# Altium schematic sheet Sheet3.SchDoc
size A; SheetNumber: 1; SheetTotal: 1
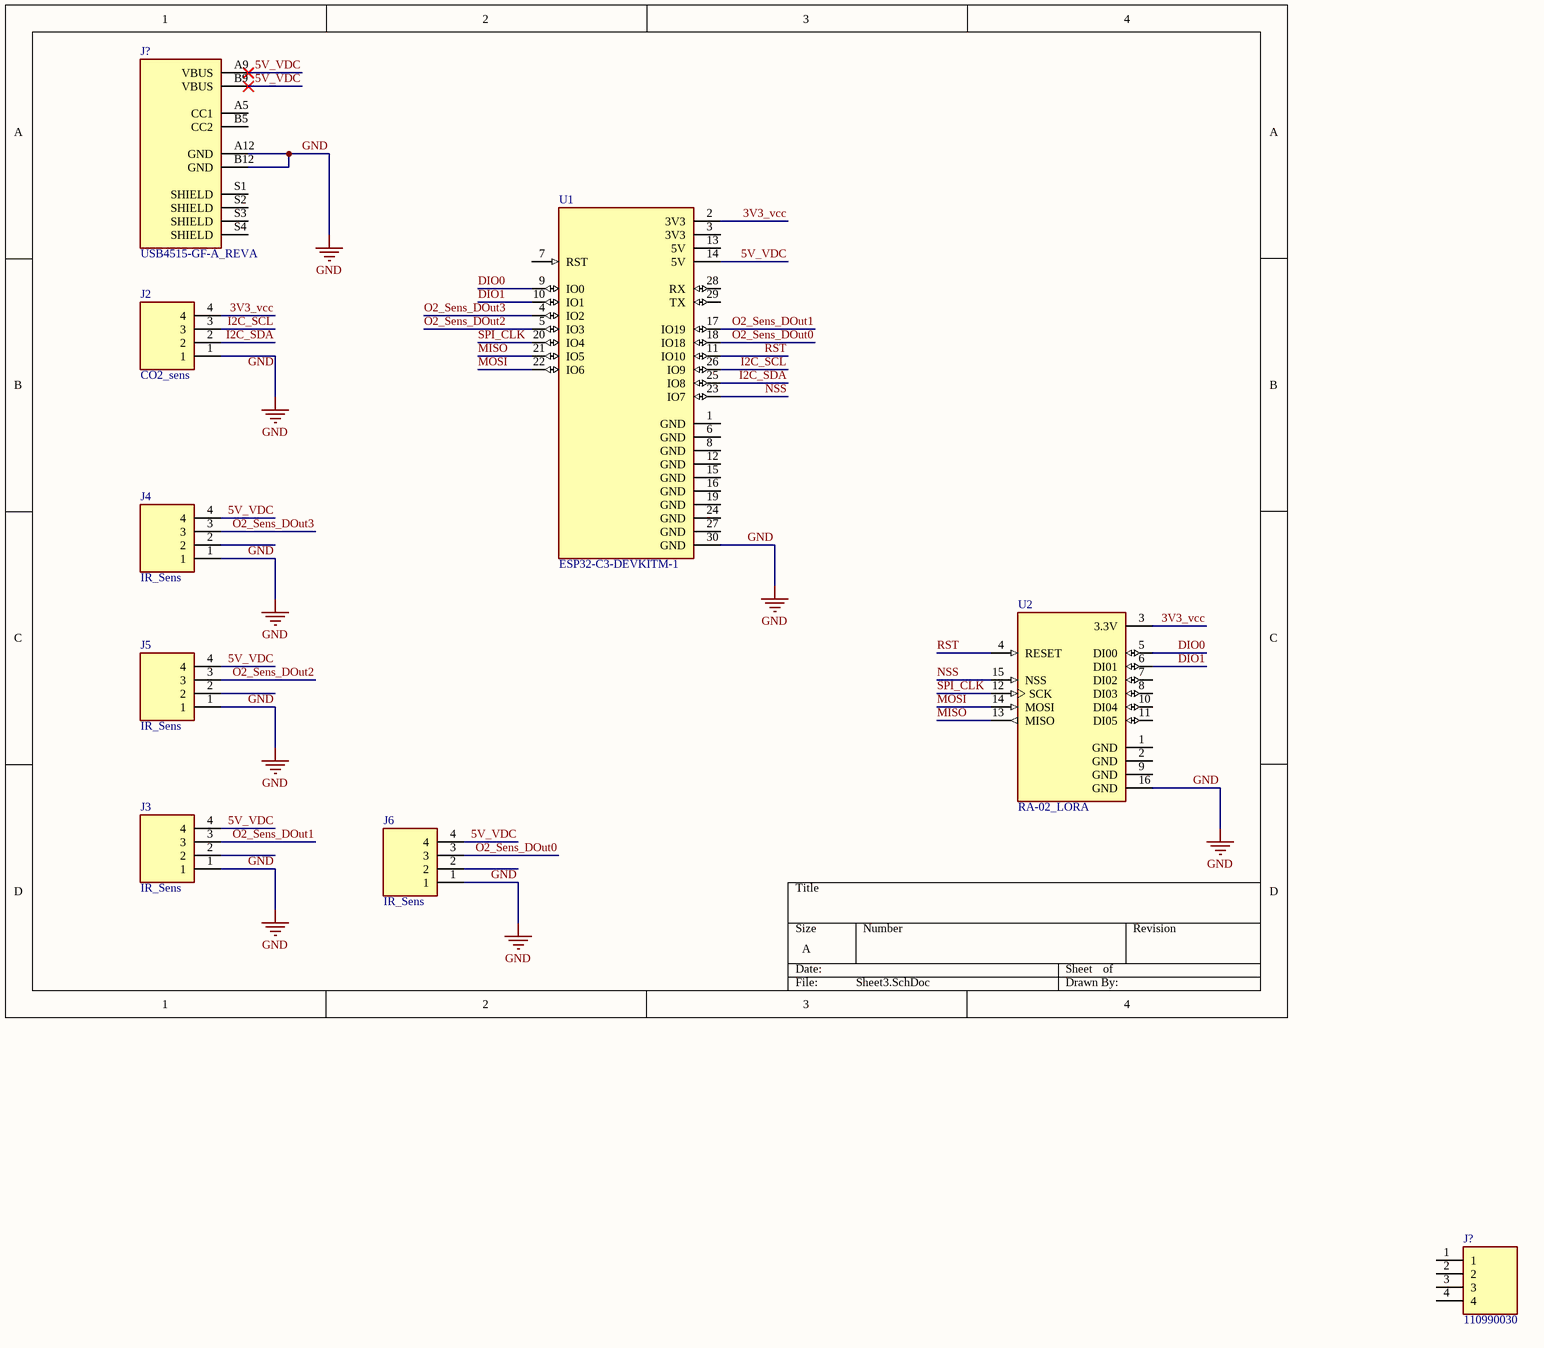
[diagram p0: Sheet3.SchDoc]

## Parts
(Parts that share a designator on the sheet are numbered #1, #2 ... from top to bottom, then left to right.)
J2  CO2_sens  [SEEED_110990030]
J3  IR_Sens  [SEEED_110990030]
J4  IR_Sens  [SEEED_110990030]
J5  IR_Sens  [SEEED_110990030]
J6  IR_Sens  [SEEED_110990030]
J?#1  USB4515-GF-A_REVA  [GCT_USB4515-GF-A_REVA]
J?#2  110990030  [SEEED_110990030]
U1  ESP32-C3-DEVKITM-1  [XCVR_ESP32-C3-DEVKITM-1]
U2  RA-02_LORA  [MODULE_RA-02_LORA]

## Nets
GND: J2.1 J3.1 J4.1 J5.1 J6.1 J?#1.A12(GND) J?#1.B12(GND) U1.30(GND) U2.16(GND)
3V3_vcc: J2.4 U1.2(3V3) U2.3(3.3V)
5V_VDC: J3.4 J4.4 J5.4 J6.4 J?#1.A9(VBUS) J?#1.B9(VBUS) U1.14(5V)
DIO0: U1.9(IO0) U2.5(DI00)
DIO1: U1.10(IO1) U2.6(DI01)
I2C_SCL: J2.3 U1.26(IO9)
I2C_SDA: J2.2 U1.25(IO8)
MISO: U1.21(IO5) U2.13(MISO)
MOSI: U1.22(IO6) U2.14(MOSI)
NSS: U1.23(IO7) U2.15(NSS)
O2_Sens_DOut0: J6.3 U1.18(IO18)
O2_Sens_DOut1: J3.3 U1.17(IO19)
O2_Sens_DOut2: J5.3 U1.5(IO3)
O2_Sens_DOut3: J4.3 U1.4(IO2)
RST: U1.11(IO10) U2.4(RESET)
SPI_CLK: U1.20(IO4) U2.12(SCK)

Not connected (* = marked no-connect by the designer): J3 2; J4 2; J5 2; J6 2; J?#1 A5(CC1) B5(CC2) S1(SHIELD) S2(SHIELD) S3(SHIELD) S4(SHIELD); J?#2 1 2 3 4; U1 1(GND) 3(3V3) 6(GND) 7(RST) 8(GND) 12(GND) 13(5V) 15(GND) 16(GND) 19(GND) 24(GND) 27(GND) 28(RX) 29(TX); U2 1(GND) 2(GND) 7(DI02) 8(DI03) 9(GND) 10(DI04) 11(DI05)

## Library data of the parts
J2-J6 J?#2 = 110990030: MF: {'manufacturer': u'Seeed Technology'}; Package: None; Price: None; Value: *; MP: 110990030; Availability: Unavailable
J?#1 = USB4515-GF-A_REVA: MF: {'manufacturer': u'Global Connector Technology'}; Package: None; Price: None; Value: *; MP: USB4515-GF-A_REVA; Availability: Unavailable
U1 = ESP32-C3-DEVKITM-1: MF: {'manufacturer': u'Espressif Systems'}; Package: None; Price: None; Value: *; MP: ESP32-C3-DEVKITM-1; Availability: Unavailable
U2 = RA-02_LORA: Ra-02 LoRa RF M5Stack Platform Evaluation Expansion Board; MF: {'manufacturer': u'AI-Thinker'}; Package: None; Price: None; Value: *; MP: RA-02_LORA; Availability: Unavailable